# EAGLE design Configuration_Board_A (EAGLE 6.3)
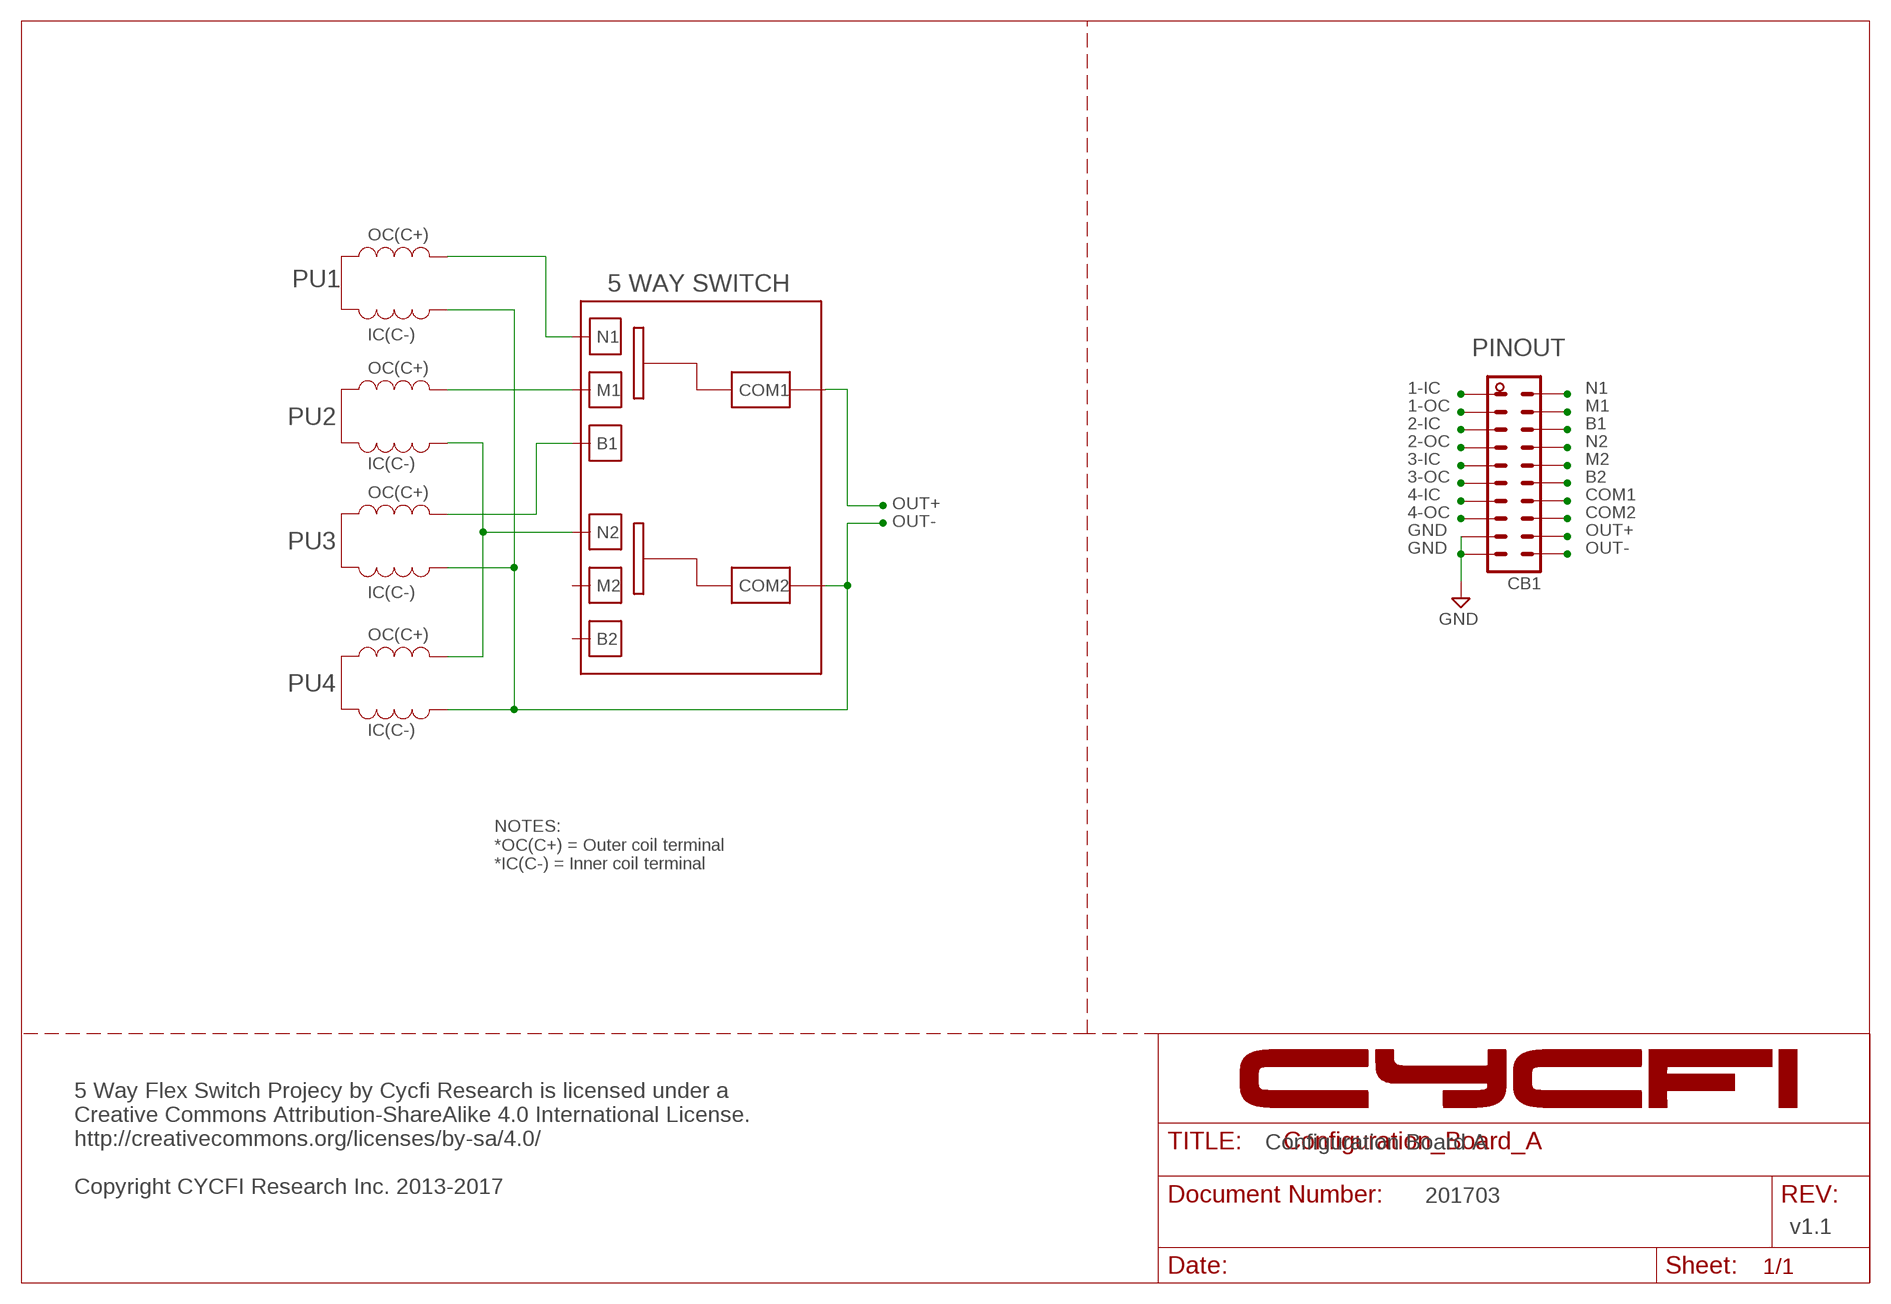
[diagram p0: schematic, sheet 1]

## Parts
CB1  CONFIGURATION_BRD_CAST  [CONFIGURATION_BRD_CAST]

## Nets
6: CB1.GND CB1.GND1 ; supply symbol labelled GND
B1: CB1.3-OC CB1.B1
B2: CB1.B2
M1: CB1.2-OC CB1.M1
M2: CB1.M2
N1: CB1.1-OC CB1.N1
N2: CB1.2-IC CB1.4-OC CB1.N2
O+: CB1.COM1 CB1.OUT+
O-: CB1.1-IC CB1.3-IC CB1.4-IC CB1.COM2 CB1.OUT-

## Notes on the sheet
- OC(C+)
- PU1 | 5 WAY SWITCH
- IC(C-) | N1
- PINOUT
- OC(C+)
- M1 | COM1 | 1-IC | N1
- 1-OC | M1
- PU2 | 2-IC | B1
- B1 | 2-OC | N2
- IC(C-) | 3-IC | M2
- 3-OC | B2
- OC(C+) | 4-IC | COM1
- OUT+
- 4-OC | COM2
- OUT-
- N2 | GND | OUT+
- PU3 | GND | OUT-
- M2 | COM2
- IC(C-)
- OC(C+) | B2
- PU4
- IC(C-)
- NOTES:
  *OC(C+) = Outer coil terminal
  *IC(C-) = Inner coil terminal
- Configuration Board A
- 5 Way Flex Switch Projecy by Cycfi Research is licensed under a 
  Creative Commons Attribution-ShareAlike 4.0 International License.
  http://creativecommons.org/licenses/by-sa/4.0/
  
  Copyright CYCFI Research Inc. 2013-2017
- 201703
- v1.1

## Library data of the parts
CB1 = CYCFI_Module_castellated:CONFIGURATION_BRD_CAST

## Board
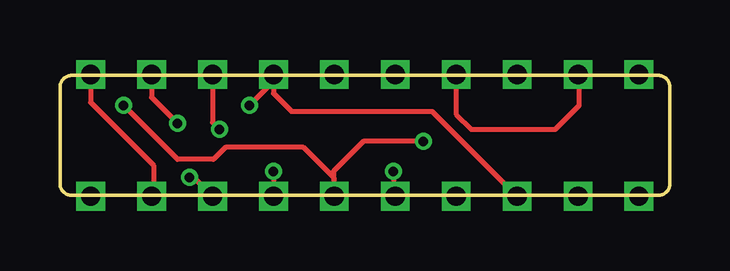
[diagram p1: board, top side]
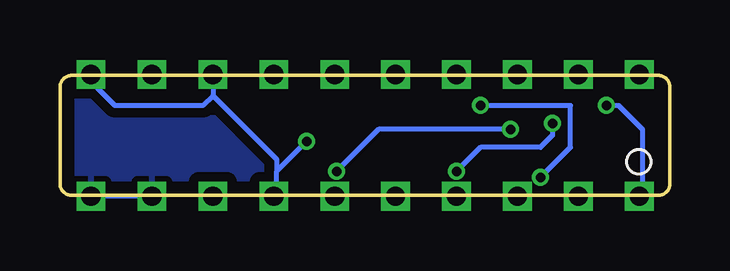
[diagram p2: board, bottom side, seen from below]

Size 25.44 x 5 mm. Coordinates in mm from the lower left corner, seen from the top.
Outline: 25.44,4.5 25.44,0.5 arc-90 24.94,0 0.5,0 arc-90 0,0.5 0,4.5 arc-90 0.5,5 24.94,5 arc-90 25.44,4.5
Copper layers (1*16): Top 0.035mm / dielectric 1.6mm / Bottom 0.035mm
Design rules "Elecrow_2-layer_PCB_eagle_rule": minimum track width 6mil, minimum drill 12mil, track to track 6mil, track to pad 8mil, pad to pad 12mil, via to via 12mil, smd to smd 0mil, copper to edge 20mil, drill to drill 10mil, minimum pad ring 6mil, minimum via ring 6mil, stop-mask expansion 0mil, vias tented up to drill 100mil, thermal gap 10mil

### Footprints (pad centres in the part's own frame; a part is rotated, then mirrored left to right if it is on the bottom)
CONFIGURATION_BRD_CAST = drill 0.8 square: 1-IC -8.89,-2.54; 1-OC -6.35,-2.54; 2-IC -3.81,-2.54; 2-OC -1.27,-2.54; 3-IC 1.27,-2.54; 3-OC 3.81,-2.54; 4-IC 6.35,-2.54; 4-OC 8.89,-2.54; B1 -3.81,2.54; B2 3.81,2.54; COM1 6.35,2.54; COM2 8.89,2.54; GND 11.43,-2.54; GND1 13.97,-2.54; M1 -6.35,2.54; M2 1.27,2.54; N1 -8.89,2.54; N2 -1.27,2.54; OUT+ 11.43,2.54; OUT- 13.97,2.54

### Placement (x,y rotation side)
CB1  10.17,2.5 0 top

### Tracks (layer width: path | path; a pad name or v marks a point on that pad's centre or on a via)
6
  Bottom 0.203: CB1.GND CB1.GND1
  pour Bottom (isolate 0.406): 0,5 0,0 25.55,0 25.55,5
  pour Top (isolate 0.305): 0,5 0,0 25.55,0 25.55,5
B1  (via drill 0.4)
  Top 0.203: CB1.B1 6.36,3.04 v6.65,2.75 | v13.9,1 13.9,0.04 CB1.3-OC
  Bottom 0.203: v6.65,2.75 12.15,2.75 v13.9,1
M1  (via drill 0.4)
  Top 0.203: v8.9,1 CB1.2-OC | CB1.M1 3.82,4.08 v4.9,3
  Bottom 0.203: v8.9,1 8.15,1.75 7.9,2 5.4,2 4.9,2.5 v4.9,3
N1
  Top 0.203: CB1.N1 1.28,3.87 3.9,1.25 3.9,0.04 CB1.1-OC
N2  (via drill 0.4)
  Top 0.203: CB1.N2 8.9,4.75 | 8.9,4.75 v7.9,3.75 | v5.4,0.75 5.57,0.75 CB1.2-IC | 8.9,4.75 8.9,4.25 9.65,3.5 15.52,3.5 CB1.4-OC
  Bottom 0.203: v7.9,3.75 4.15,3.75 4.15,2 v5.4,0.75
O+
  Top 0.203: CB1.COM1 16.52,3.38 17.15,2.75 20.65,2.75 21.65,3.75 21.65,4.99 CB1.OUT+
O-  (via drill 0.4)
  Top 0.203: v15.15,2.25 12.65,2.25 11.4,1 11.4,0 CB1.3-IC 11.44,0.71 10.15,2 6.9,2 6.4,1.5 4.9,1.5 v2.65,3.75
  Bottom 0.203: CB1.COM2 19.06,4.16 | 19.06,4.16 16.4,1.5 16.4,1 | CB1.4-IC 16.4,0.08 16.4,1 | 16.4,1 v15.15,2.25 | v2.65,3.75 2.15,3.75 1.15,2.75 1.15,0.09 CB1.1-IC | CB1.OUT- 24.14,4.74 23.15,3.75 19.47,3.75 19.06,4.16